# EAGLE design usb_rs485_fd_v1 (EAGLE 5.07)
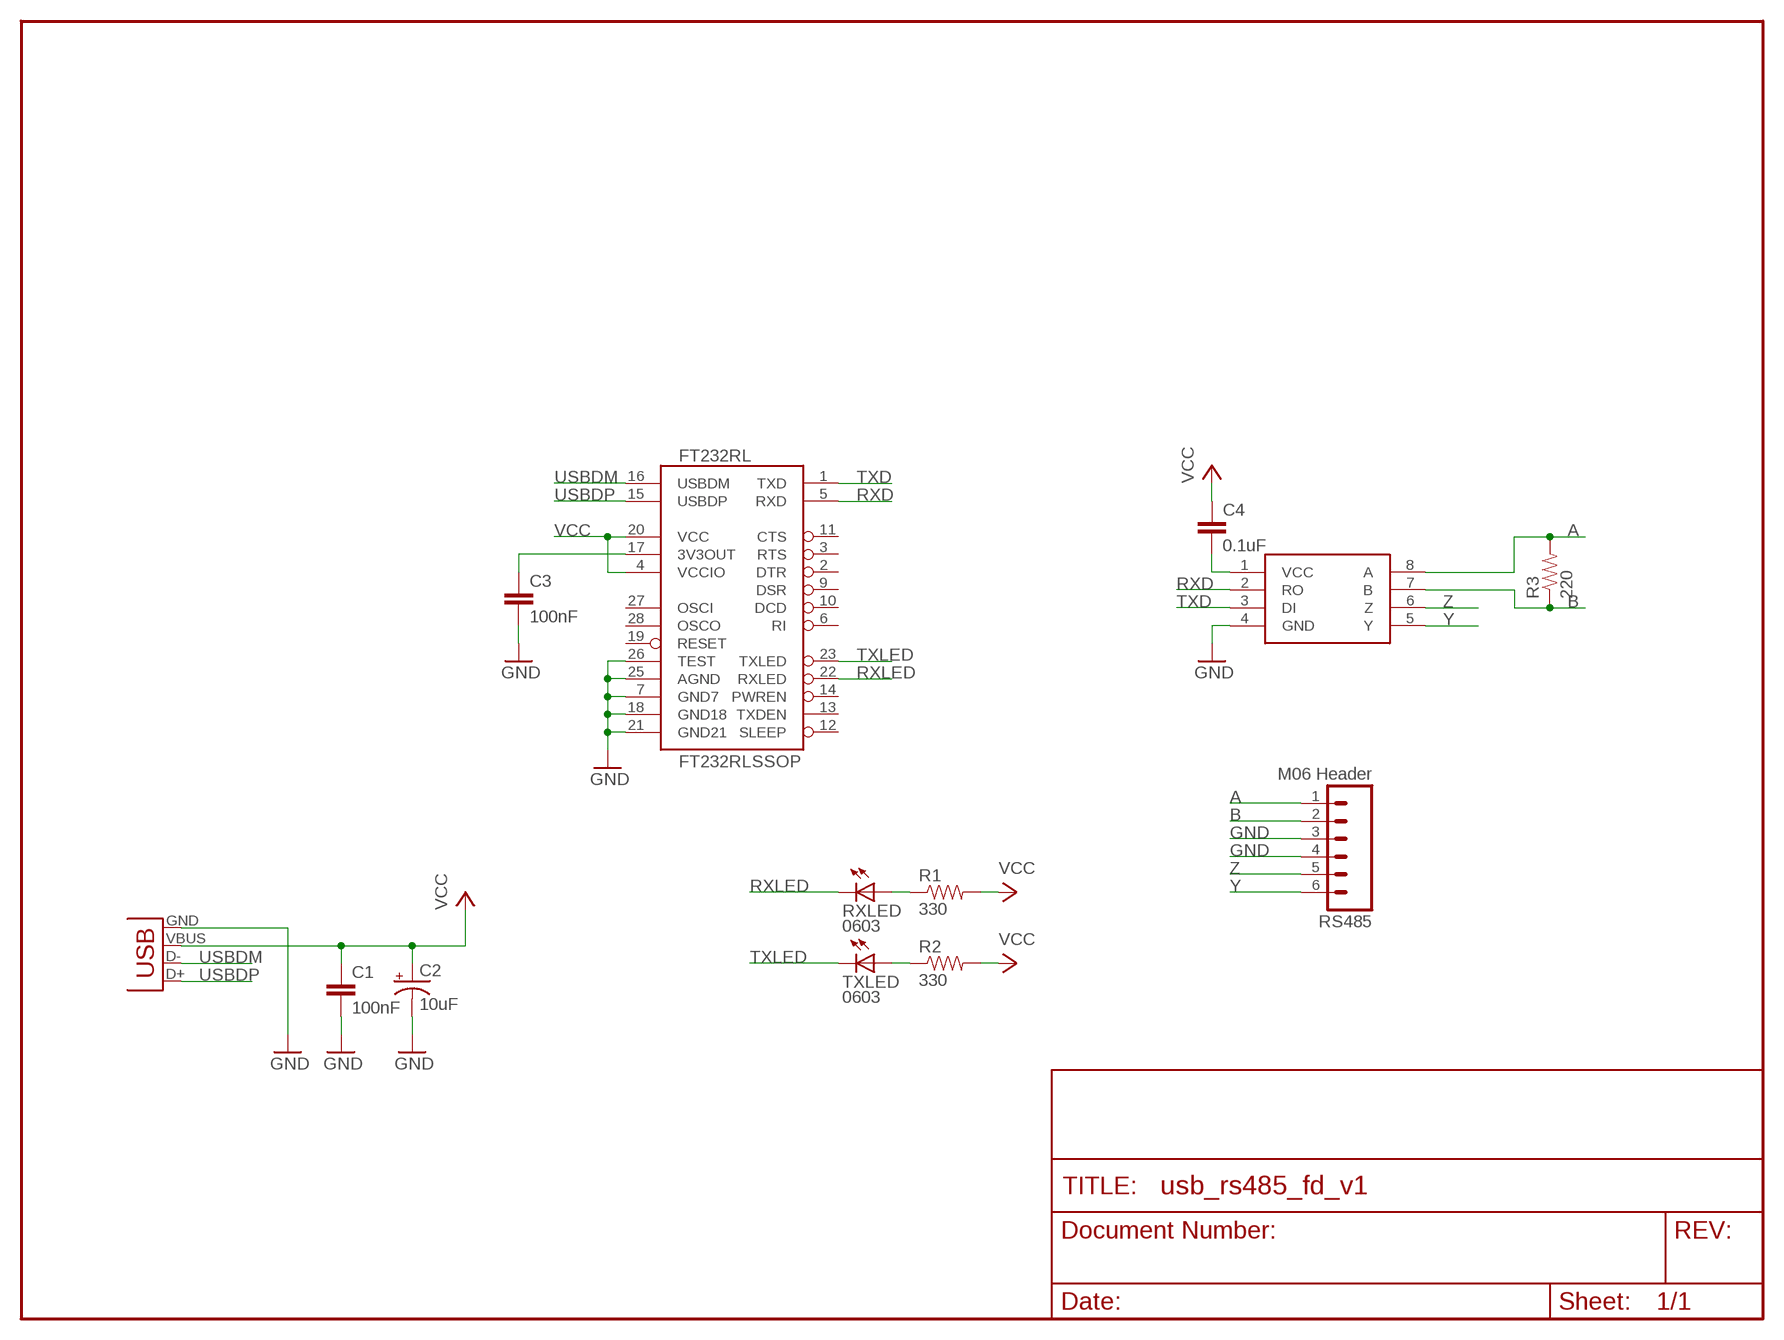
[diagram p0: schematic, sheet 1]

## Parts
C1  100nF  CAP0603-CAP  [0603-CAP]
C2  10uF  CAP_POL1206  [EIA3216]
C3  100nF  CAP0603-CAP  [0603-CAP]
C4  0.1uF  CAP0603-CAP  [0603-CAP]
FT232RL  FT232RLSSOP  [SSOP28DB]
MAX3077  MAX3087  [SO08]
R1  330  RESISTOR0603-RES  [0603-RES]
R2  330  RESISTOR0603-RES  [0603-RES]
R3  220  RESISTOR0603-RES  [0603-RES]
RS485  M06 Header  M06SIP  [1X06]
RXLED  0603  LED0603  [LED-0603]
TXLED  0603  LED0603  [LED-0603]
USB_MINI_B  USBSMD  [USB-MINIB]

## Nets
A: MAX3077.8(A) R3.2 RS485.1
B: MAX3077.7(B) R3.1 RS485.2
GND: C1.2 C2.C(-) C3.2 FT232RL.7(GND7) FT232RL.18(GND18) FT232RL.21(GND21) FT232RL.25(AGND) FT232RL.26(TEST) MAX3077.4(GND) RS485.3 RS485.4 USB_MINI_B.GND
N$1: R1.1 RXLED.A
N$2: R2.1 TXLED.A
N$3: C3.1 FT232RL.17(3V3OUT)
N$4: C4.2 MAX3077.1(VCC)
RXD: FT232RL.5(RXD) MAX3077.2(RO)
RXLED: FT232RL.22(RXLED) RXLED.C
TXD: FT232RL.1(TXD) MAX3077.3(DI)
TXLED: FT232RL.23(TXLED) TXLED.C
USBDM: FT232RL.16(USBDM) USB_MINI_B.D-
USBDP: FT232RL.15(USBDP) USB_MINI_B.D+
VCC: C1.1 C2.A(+) C4.1 FT232RL.4(VCCIO) FT232RL.20(VCC) R1.2 R2.2 USB_MINI_B.VBUS
Y: MAX3077.5(Y) RS485.6
Z: MAX3077.6(Z) RS485.5
Unconnected: FT232RL.2(DTR) FT232RL.3(RTS) FT232RL.6(RI) FT232RL.9(DSR) FT232RL.10(DCD) FT232RL.11(CTS) FT232RL.12(SLEEP) FT232RL.13(TXDEN) FT232RL.14(PWREN) FT232RL.19(RESET) FT232RL.27(OSCI) FT232RL.28(OSCO)

## Library data of the parts
C1 C3 C4 = SparkFun:CAP: Capacitor Standard 0603 ceramic capacitor, and 0.1" leaded capacitor.
C2 = SparkFun:CAP_POL: Capacitor Polarized These are standard SMD and PTH capacitors. Normally 10uF, 47uF, and 100uF in electrolytic and tantalum varieties. Always verify the external diameter of the through hole cap, it varies with capacity, voltage, and manufacturer. The EIA devices should be standard.
FT232RL = SparkFun:FT232RL: USB UART FT232RL 4th Generation USB UART (USB <-> Serial) Controller. Spark Fun Electronics SKU : COM-00650
MAX3077 = jcole:MAX3087
R1-R3 = SparkFun:RESISTOR: Resistor Basic schematic elements and footprints for 0603, 1206, and PTH 1/10th watt (small) resistors.
RS485 = SparkFun:M06: Header 6 Standard 6-pin 0.1" header. Use with straight break away headers (SKU : PRT-00116), right angle break away headers (PRT-00553), swiss pins (PRT-00743), machine pins (PRT-00117), and female headers (PRT-00115). Molex polarized connector foot print use with SKU : PRT-08094 with associated crimp pins and housings. NOTES ON THE VARIANTS LOCK and LOCK_LONGPADS... This footprint was designed to help hold the alignment of a through-hole component (i.e. 6-pin header) while soldering it into place. You may notice that each hole has been shifted either up or down by 0.005 of an inch from it's more standard position (which is a perfectly straight line). This slight alteration caused the pins (the squares in the middle) to touch the edges of the holes. Because they are alternating, it causes a "brace" to hold the component in place. 0.005 has proven to be the perfect amount of "off-center" position when using our standard breakaway headers. Although looks a little odd when you look at the bare footprint, once you have a header in there, the alteration is very hard to notice. Also, if you push a header all the way into place, it is covered up entirely on the bottom side. This idea of altering the position of holes to aid alignment will be further integrated into the Sparkfun Library for other footprints. It can help hold any component with 3 or more connection pins.
RXLED TXLED = SparkFun:LED: LEDs Standard schematic elements and footprints for 5mm, 3mm, 1206, and 0603 sized LEDs. 5mm - Spark Fun Electronics SKU : COM-00529 (and others)
USB_MINI_B = SparkFun:USB: USB Connectors USB-B-PTH is fully proven SKU : PRT-00139 USB-miniB is fully proven SKU : PRT-00587 USB-A-PCB is untested. USB-A-H is throughly reviewed, but untested. Spark Fun Electronics SKU : PRT-00437 USB-B-SMT is throughly reviewed, but untested. Needs silkscreen touching up. USB-A-S has not been used/tested USB-MB-H has not been used/tested

## Board
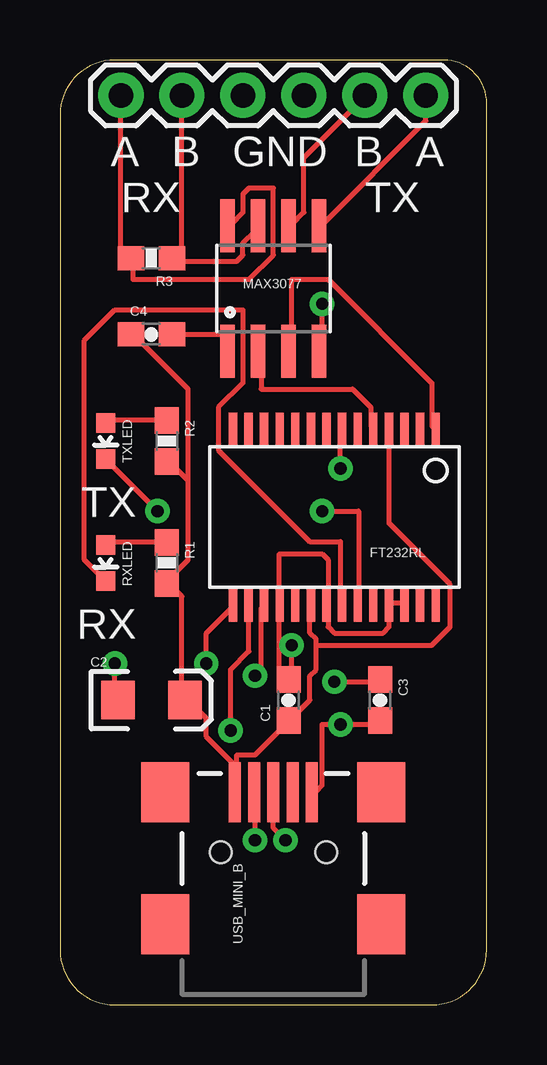
[diagram p1: board, top side]
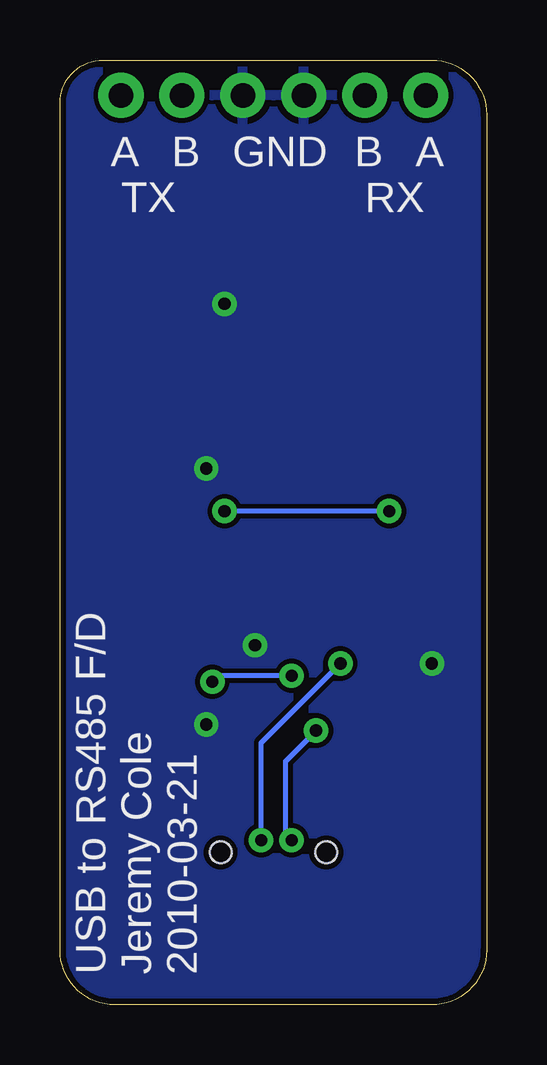
[diagram p2: board, bottom side, seen from below]

Size 17.78 x 39.37 mm. Coordinates in mm from the lower left corner, seen from the top.
Outline: 15.49,0 arc90 17.78,2.29 17.78,37.57 arc90 15.98,39.37 2.29,39.37 arc90 0,37.08 0,2.29 arc90 2.29,0 15.49,0
Copper layers (1*16): Top 0.035mm / dielectric 1.5mm / Bottom 0.035mm
Design rules "SparkFun": minimum track width 8mil, minimum drill 20mil, track to track 8mil, track to pad 8mil, pad to pad 8mil, via to via 8mil, smd to smd 8mil, copper to edge 10mil, drill to drill 8mil, minimum pad ring 12mil, minimum via ring 10mil, stop-mask expansion 4mil, vias tented up to drill 25mil, thermal gap 10mil

### Footprints (pad centres in the part's own frame; a part is rotated, then mirrored left to right if it is on the bottom)
0603-CAP = smd 1.1 x 1: 1 -0.85,0; 2 0.85,0
EIA3216 = smd 1.4 x 1.6: A 1.4,0; C -1.4,0
SSOP28DB = smd 0.348 x 1.397: 1 -4.225,-3.656; 2 -3.575,-3.656; 3 -2.925,-3.656; 4 -2.275,-3.656; 5 -1.625,-3.656; 6 -0.975,-3.656; 7 -0.325,-3.656; 8 0.325,-3.656; 9 0.975,-3.656; 10 1.625,-3.656; 11 2.275,-3.656; 12 2.925,-3.656; 13 3.575,-3.656; 14 4.225,-3.656; 15 4.225,3.656; 16 3.575,3.656; 17 2.925,3.656; 18 2.275,3.656; 19 1.625,3.656; 20 0.975,3.656; 21 0.325,3.656; 22 -0.325,3.656; 23 -0.975,3.656; 24 -1.625,3.656; 25 -2.275,3.656; 26 -2.925,3.656; 27 -3.575,3.656; 28 -4.225,3.656
SO08 = smd 0.61 x 2.21: 1 -1.905,-2.616; 2 -0.635,-2.616; 3 0.635,-2.616; 4 1.905,-2.616; 5 1.905,2.616; 6 0.635,2.616; 7 -0.635,2.616; 8 -1.905,2.616
0603-RES = smd 1.1 x 1: 1 -0.85,0; 2 0.85,0
1X06 = drill 1.016 pad 1.88 round: 1 0,0; 2 2.54,0; 3 5.08,0; 4 7.62,0; 5 10.16,0; 6 12.7,0
LED-0603 = smd 0.8 x 0.8: A 0,-0.75; C 0,0.75
USB-MINIB = smd 2.5 x 0.5: D+ 2.5,0; D- 2.5,0.8; GND 2.5,-1.6; ID 2.5,-0.8; VBUS 2.5,1.6 | smd 2.5 x 2: GND@1 -3,-4.5; GND@2 -3,4.5; GND@3 2.5,4.5; GND@4 2.5,-4.5 | hole 0.9: 0,2.2; 0,-2.2

### Placement (x,y rotation side)
C1  9.53,12.7 90 top
C2  3.81,12.7 0 top
C3  13.34,12.7 270 top
C4  3.81,27.94 0 top
FT232RL  11.43,20.32 180 top
MAX3077  8.89,29.84 0 top
R1  4.45,18.41 270 top
R2  4.45,23.5 270 top
R3  3.81,31.11 180 top
RS485  2.54,37.9 0 top
RXLED  1.91,18.41 180 top
TXLED  1.91,23.5 180 top
USB_MINI_B  8.89,6.35 90 top

### Tracks (layer width: path | path; a pad name or v marks a point on that pad's centre or on a via)
A
  Top 0.203: RS485.1 2.54,31.5 2.79,31.24 R3.2 3.05,30.99 3.05,30.23 7.87,30.23 8.89,31.24 8.89,34.04 7.87,34.04 7.62,33.78 7.62,33.02 7.11,32.51 MAX3077.8
B
  Top 0.203: RS485.2 5.08,31.5 4.83,31.24 R3.1 4.83,30.99 7.37,30.99 7.62,31.24 7.62,31.75 8.13,32.26 MAX3077.7
GND  (via drill 0.51)
  Top 0.203: FT232RL.26 14.22,16.76 13.72,16.76 FT232RL.25 13.72,16.51 13.72,15.75 13.46,15.49 11.43,15.49 11.18,15.75 11.18,16.51 FT232RL.21 11.18,16.76 11.18,18.54 10.92,18.8 9.14,18.8 9.14,16.76 FT232RL.18 9.14,16.51 9.14,13.97 9.4,13.72 C1.2 9.65,13.72 v9.65,14.99 | C3.2 13.21,11.68 v11.68,11.68 10.92,11.68 10.92,9.14 10.67,8.89 USB_MINI_B.GND | v11.68,22.35 11.68,23.88 FT232RL.7 | v2.29,14.22 2.29,12.7 C2.C | v10.92,29.21 10.92,27.43 MAX3077.4
  pour Bottom: 0.2,0.2 17.58,0.2 17.58,38.96 0.2,38.96
N$1
  Top 0.203: RXLED.A 2.03,19.3 4.32,19.3 R1.1
N$2
  Top 0.203: TXLED.A 2.03,24.38 4.32,24.38 R2.1
N$3  (via drill 0.51)
  Top 0.203: v11.43,13.46 13.21,13.46 C3.1 | v8.13,13.72 8.38,13.97 8.38,16.51 FT232RL.17
  Bottom 0.203: v11.43,13.46 11.18,13.72 v8.13,13.72
N$4
  Top 0.203: C4.2 6.86,27.94 6.86,27.43 MAX3077.1
RXD
  Top 0.203: FT232RL.5 12.95,24.13 12.95,24.89 12.19,25.65 8.38,25.65 8.38,27.18 MAX3077.2
RXLED
  Top 0.203: RXLED.C 1.78,17.78 1.02,18.54 1.02,27.69 2.29,28.96 7.62,28.96 7.62,25.91 6.6,24.89 6.6,23.11 10.41,19.3 11.68,19.3 11.68,16.76 FT232RL.22
TXD
  Top 0.203: FT232RL.1 15.49,24.13 15.49,25.91 11.18,30.23 9.65,30.23 9.65,27.43 MAX3077.3
TXLED  (via drill 0.51)
  Top 0.203: v4.06,20.57 2.03,22.61 TXLED.C | v10.92,20.57 12.45,20.57 12.45,16.76 FT232RL.23
  Bottom 0.203: v4.06,20.57 v10.92,20.57
USBDM  (via drill 0.51)
  Top 0.203: v7.11,11.43 7.11,13.97 7.87,14.73 7.87,16.51 FT232RL.16 | v8.13,6.86 8.13,8.64 USB_MINI_B.D-
  Bottom 0.203: v7.11,11.43 8.38,10.16 8.38,6.86 v8.13,6.86
USBDP  (via drill 0.51)
  Top 0.203: v6.1,14.22 6.1,15.49 7.11,16.51 FT232RL.15 | v9.4,6.86 8.89,7.37 USB_MINI_B.D+
  Bottom 0.203: v6.1,14.22 9.4,10.92 v9.4,6.86
VCC
  Top 0.203: 5.33,21.84 4.57,22.61 R2.2 | 5.33,21.84 5.33,18.54 4.57,17.78 R1.2 4.57,17.53 5.08,17.02 5.08,12.7 C2.A 5.33,12.7 6.1,11.94 6.1,11.18 7.37,9.91 | 5.33,21.84 5.33,25.65 3.05,27.94 C4.1 | 7.37,9.91 7.37,8.89 USB_MINI_B.VBUS 7.37,9.91 | 7.37,9.91 7.37,10.41 8.13,10.41 9.4,11.68 C1.1 9.65,11.94 10.41,12.7 10.41,13.72 10.67,13.97 10.67,14.99 | 10.67,14.99 10.67,15.24 10.41,15.49 10.41,16.51 FT232RL.20 | 10.67,14.99 15.49,14.99 16.26,15.75 16.26,17.53 13.72,20.07 13.72,23.88 FT232RL.4
Y
  Top 0.203: MAX3077.5 10.92,32.51 15.24,36.83 RS485.6
Z
  Top 0.203: MAX3077.6 9.65,32.51 10.16,33.02 10.16,35.31 12.7,37.85 RS485.5

### Text on the board
tNames: A | B | GND | B | A | RX | TX | TX | RX
bNames: A | B | GND | B | A | RX | TX | 2010-03-21 | Jeremy Cole | USB to RS485 F/D